# Altium schematic sheet Eload Gen 3 Power Module - User Inferface.SchDoc
size B
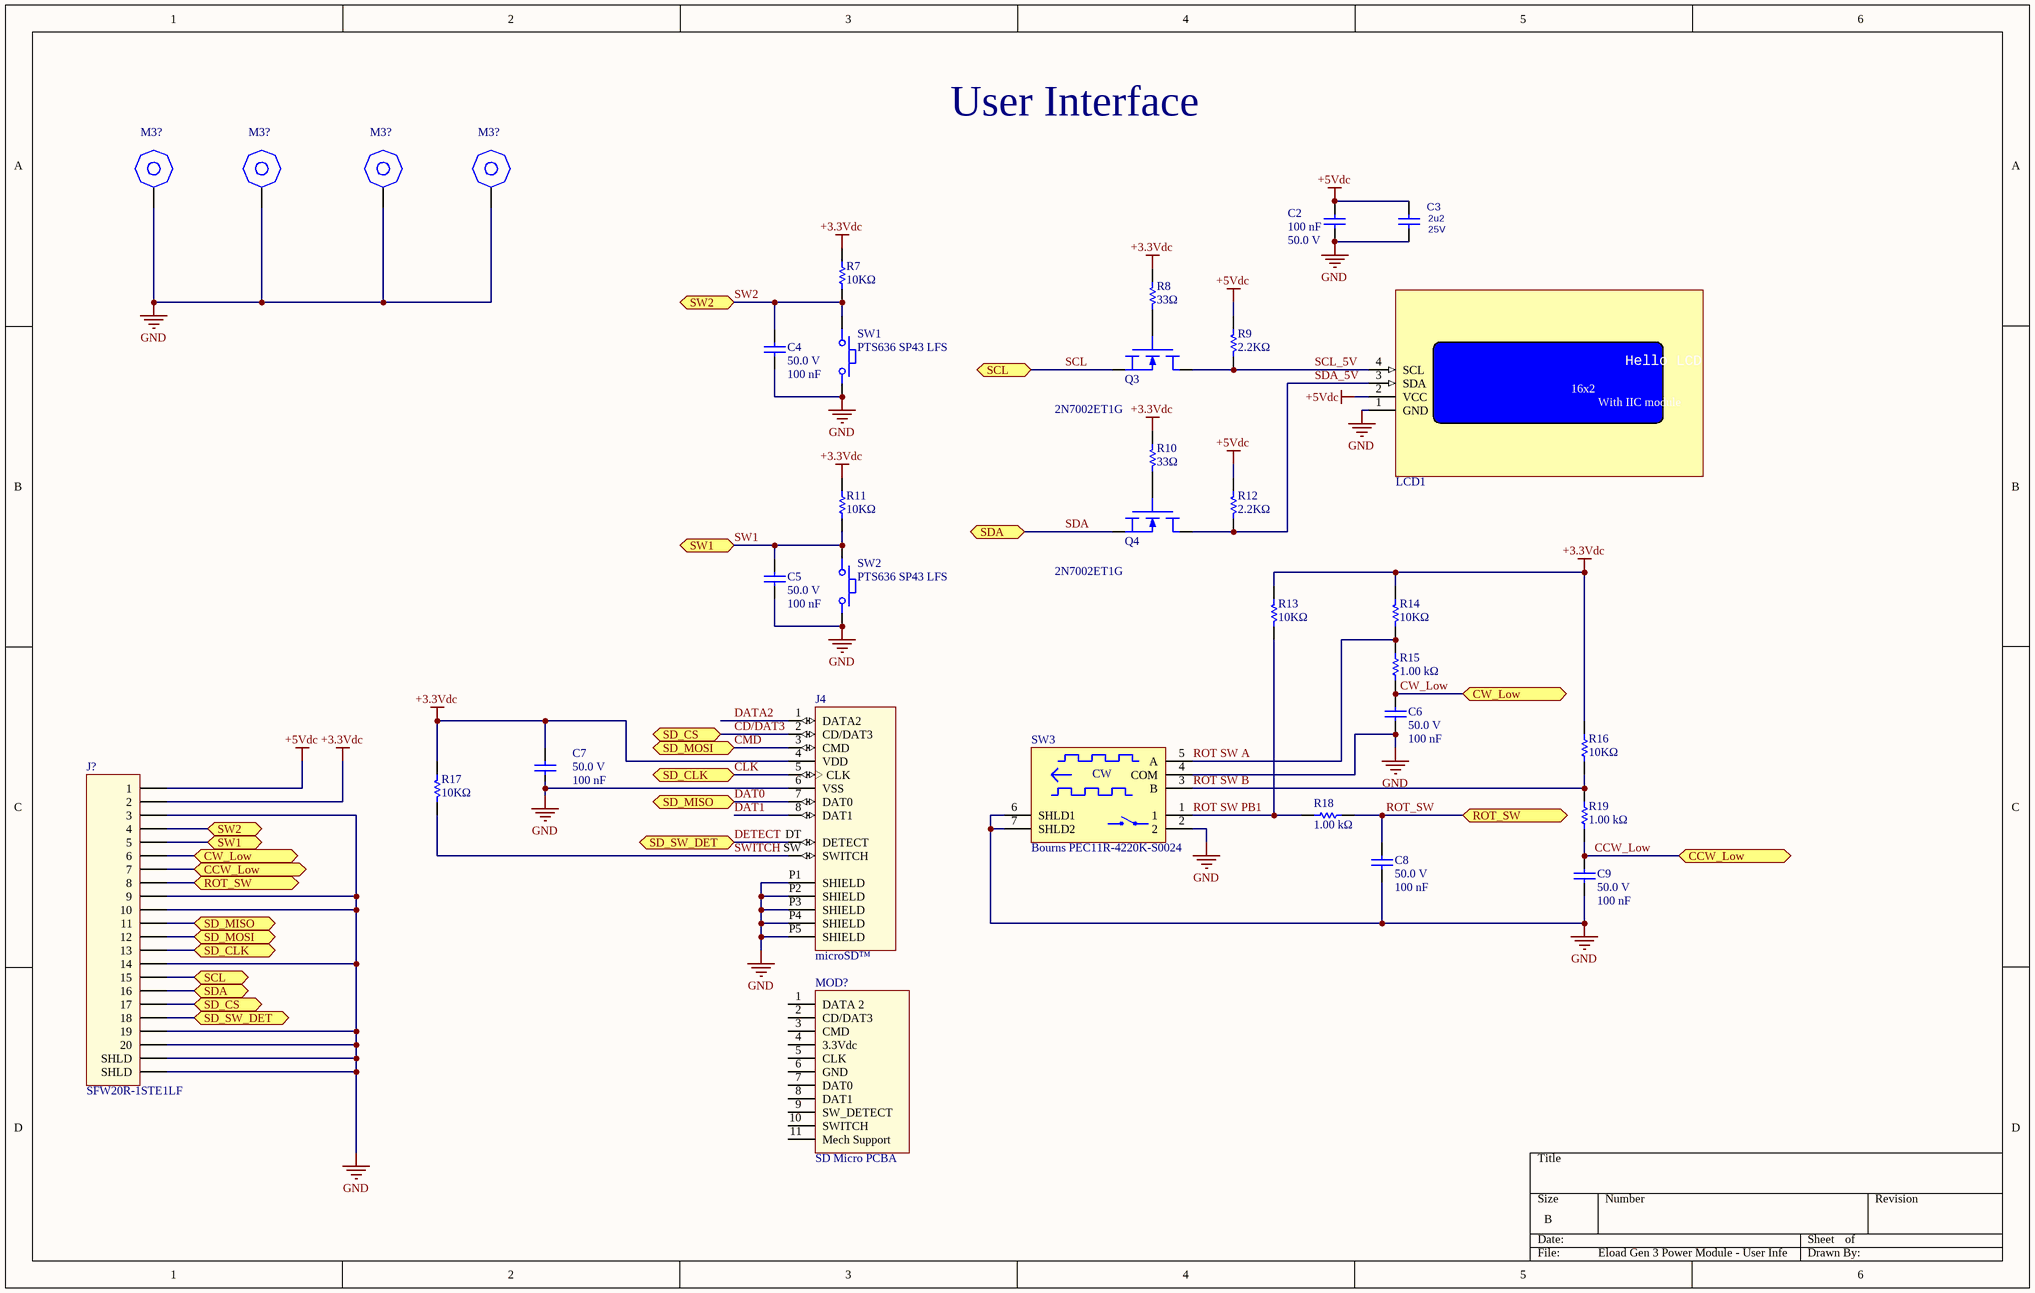
[diagram p0: Eload Gen 3 Power Module - User Inferface.SchDoc]

## Parts
(Parts that share a designator on the sheet are numbered #1, #2 ... from top to bottom, then left to right.)
C2  Voltage Rating (DC): 50.0 V  Capacitance: 100 nF  [Cap,0805]  (hidden comment: 08055C104JAT2A)
C3  2u2  Voltage: 25V  [CAP, 0805, HD]  (net tie)
C4  Voltage Rating (DC): 50.0 V  Capacitance: 100 nF  [CAP, 0805, HD]  (hidden comment: 08055C104JAT2A)
C5  Voltage Rating (DC): 50.0 V  Capacitance: 100 nF  [CAP, 0805, HD]  (hidden comment: 08055C104JAT2A)
C6  Voltage Rating (DC): 50.0 V  Capacitance: 100 nF  [CAP, 0805, HD]  (hidden comment: 08055C104JAT2A)
C7  Voltage Rating (DC): 50.0 V  Capacitance: 100 nF  [Cap,0805]  (hidden comment: 08055C104JAT2A)
C8  Voltage Rating (DC): 50.0 V  Capacitance: 100 nF  [CAP, 0805, HD]  (hidden comment: 08055C104JAT2A)
C9  Voltage Rating (DC): 50.0 V  Capacitance: 100 nF  [CAP, 0805, HD]  (hidden comment: 08055C104JAT2A)
J4  Card Type: microSD™  [Conn,SD micro,503182-1852]  (hidden comment: 5031821852)
J?  SFW20R-1STE1LF  [Connector,FlatFlex,20Pin,RA]
LCD1  LCD, 20x4  [LCD Module 16x2 - IIC MOD]  (value not drawn)
M3?#1  M3 hex Standoff  [Standoff,Hex,M3,8mm]  (value not drawn)  (mechanical)
M3?#2  M3 hex Standoff  [Standoff,Hex,M3,8mm]  (value not drawn)  (mechanical)
M3?#3  M3 hex Standoff  [Standoff,Hex,M3,8mm]  (value not drawn)  (mechanical)
M3?#4  M3 hex Standoff  [Standoff,Hex,M3,8mm]  (value not drawn)  (mechanical)
MOD?  Discription: SD Micro PCBA  [Mod, SD Card Connector Breakout]  (hidden comment: SD Card Connector Breakout)
Q3  2N7002ET1G  [SOT23-3]
Q4  2N7002ET1G  [SOT23-3]
R7  Resistance: 10KΩ  [res, 0805, HD]  (hidden comment: Vishay / Dale CRCW080510K0FKTA)
R8  Resistance: 33Ω  [res, 0805, HD]  (hidden comment: CR0805-JW-330ELF)
R9  Resistance: 2.2KΩ  [res, 0805, HD]  (hidden comment: CRCW08052K20FKEA)
R10  Resistance: 33Ω  [res, 0805, HD]  (hidden comment: CR0805-JW-330ELF)
R11  Resistance: 10KΩ  [res, 0805, HD]  (hidden comment: Vishay / Dale CRCW080510K0FKTA)
R12  Resistance: 2.2KΩ  [res, 0805, HD]  (hidden comment: CRCW08052K20FKEA)
R13  Resistance: 10KΩ  [res, 0805, HD]  (hidden comment: Vishay / Dale CRCW080510K0FKTA)
R14  Resistance: 10KΩ  [res, 0805, HD]  (hidden comment: Vishay / Dale CRCW080510K0FKTA)
R15  Resistance: 1.00 kΩ  [res, 0805, HD]  (hidden comment: Vishay CRCW08051K00JNEA)
R16  Resistance: 10KΩ  [res, 0805, HD]  (hidden comment: Vishay / Dale CRCW080510K0FKTA)
R17  Resistance: 10KΩ  [res, 0805, HD]  (hidden comment: Vishay / Dale CRCW080510K0FKTA)
R18  Resistance: 1.00 kΩ  [res, 0805, HD]  (hidden comment: Vishay CRCW08051K00JNEA)
R19  Resistance: 1.00 kΩ  [res, 0805, HD]  (hidden comment: Vishay CRCW08051K00JNEA)
SW1  PTS636 SP43 LFS  [PTS636 SP43 LFS]
SW2  PTS636 SP43 LFS  [PTS636 SP43 LFS]
SW3  Bourns PEC11R-4220K-S0024  [Rotary encoder]

## Ports
CCW_Low, CW_Low, ROT_SW, SCL, SD_CLK, SD_CS, SD_MISO, SD_MOSI, SD_SW_DET, SDA, SW1, SW2

## Nets
+3.3Vdc: C7.2 J4.4(VDD) J?.2 R7.1 R8.1 R10.1 R11.1 R13.2 R14.2 R16.1 R17.1
+5Vdc: C2.2 C3.2 J?.1 LCD1.2(VCC) R9.2 R12.2
GND: C2.1 C3.1 C4.1 C5.1 C6.1 C7.1 C8.1 C9.1 J4.6(VSS) J4.P1(SHIELD) J4.P2(SHIELD) J4.P3(SHIELD) J4.P4(SHIELD) J4.P5(SHIELD) J?.3 J?.9 J?.10 J?.14 J?.19 J?.20 J?.21(SHLD) J?.22(SHLD) LCD1.1(GND) M3?#1.0 M3?#2.0 M3?#3.0 M3?#4.0 SW1.2 SW2.2 SW3.2 SW3.4(COM) SW3.6(SHLD1) SW3.7(SHLD2)
CCW_Low: C9.2 J?.7 R19.2 ; port CCW_Low
CD/DAT3: J4.2(CD/DAT3) J?.17 ; port SD_CS
CLK: J4.5(CLK) J?.13 ; port SD_CLK
CMD: J4.3(CMD) J?.12 ; port SD_MOSI
CW_Low: C6.2 J?.6 R15.2 ; port CW_Low
DAT0: J4.7(DAT0) J?.11 ; port SD_MISO
DAT1: J4.8(DAT1)
DATA2: J4.1(DATA2)
DETECT: J4.DT(DETECT) J?.18 ; port SD_SW_DET
ROT SW A: R14.1 R15.1 SW3.5(A)
ROT SW B: R16.2 R19.1 SW3.3(B)
ROT SW PB1: R13.1 R18.1 SW3.1
ROT_SW: C8.2 J?.8 R18.2 ; port ROT_SW
SCL: J?.15 Q3.2(S) ; port SCL
SCL_5V: LCD1.4(SCL) Q3.3(D) R9.1
SDA: J?.16 Q4.2(S) ; port SDA
SDA_5V: LCD1.3(SDA) Q4.3(D) R12.1
SW1: C5.2 J?.5 R11.2 SW2.1 ; port SW1
SW2: C4.2 J?.4 R7.2 SW1.1 ; port SW2
SWITCH: J4.SW(SWITCH) R17.2
NetQ3_1: Q3.1(G) R8.2
NetQ4_1: Q4.1(G) R10.2

Not connected (* = marked no-connect by the designer): MOD? 1(DATA_2) 2(CD/DAT3) 3(CMD) 4(3.3Vdc) 5(CLK) 6(GND) 7(DAT0) 8(DAT1) 9(SW_DETECT) 10(SWITCH) 11(Mech_Support)

## Notes on the sheet
- User Interface
- (in symbol LCD, 16x2, IIC) Hello LCD World; 16x2; With IIC module
- (in symbol Rotary encoder, PEC11R-4220K-S0024) CW

## Library data of the parts
C2 C4-C9 = Cap,0805,100nf,50V,5%,08055C104JAT2A: Capacitor; Ceramic; Cap 0.1 uF; Tol 5%; Vol-Rtg 50 VDC; SMT; 0805; X7R; Tape & Reel; Lead-Free Status: Lead Free; Case/Package (SI): 2012; Insulation Resistance: 100 GΩ; Detailed Description: 0.1µF ±5% 50V Ceramic Capacitor X7R 0805 (2012 Metric); Mounting Style: Surface Mount; Packaging: Tape & Reel (TR), Cut Tape (CT); RoHS: Compliant; Size-Width: 1.24 mm; Case/Package: 0805; Number of Pins: 2; digikey url: http://www.digikey.ca/product-detail/en/avx-corporation/08055C104JAT2A/478-3352-1-ND/930144; REACH SVHC Compliance: No SVHC; Dielectric Characteristic: X7R; Capacitance Tolerance: ±5%; Size-Length: 2.01 mm; Size-Height: 710 µm; Size-Thickness: 940 µm; Manufacturer Part Number: 08055C104JAT2A; Octopart URL: http://octopart.com/08055c104jat2a-avx-55388010; Operating Temperature: -55°C ~ 125°C; Supplier 1: Digi-Key; Supplier Part Number 1: 478-3352-1-ND
C3 = Cap,0805,2.2uF,10%,25V: Cap,SMD,MLCC,2.2uF 25V X7R 10%,0805; Manufacturer: Murata; Manufacturer P/N: GRM21BR71E225KA73L (t&r, 3Kpcs); P/N: 211-121-19; iPS: 951-22501-R1; Not Stuffed: N/S; Temperature Category: -55~125 degC.; Fast Supplier: Digi-Key; Fast Supplier P/N: 490-3331-1-ND; Type: X7R
J4 = Conn,SD Micro,10 (8 + 2) Position,SMD,RA,5031821852: MICRO SD NORMAL ULTRALOWPRO8CKTE; Manufacturer: Molex; Detailed Description: 10 (8 + 2) Position Card Connector microSD™ Surface Mount, Right Angle Gold; Categories: Connectors, Interconnects   Memory Connectors - PC Card Sockets; Connector Type: Connector and Ejector; Insertion, Removal Method: Push In, Push Out; mfg P/N: 5031821852; Series: 503182; Part Status: Active; Number of Positions: 10 (8 + 2); Mounting Type: Surface Mount, Right Angle; Features: Switch; Height Above Board: 0.057" (1.45mm); Mounting Feature: Normal, Standard - Top; Contact Finish: Gold
J? = Connector,FFC,SMD,20Pin,1mmSpc,SFW20R-1STE1LF: CONN FFC BOTTOM 20POS 1.00MM R/A; Manufacturer: Amphenol ICC (FCI); Detailed Description: 20 Position FFC, FPC Connector Contacts, Bottom 0.039" (1.00mm) Surface Mount, Right Angle; Categories: Connectors, Interconnects   FFC, FPC (Flat Flexible) Connectors; Flat Flex Type: FFC, FPC; Connector/Contact Type: Contacts, Bottom; Number of Positions: 20; Pitch: 0.039" (1.00mm); FFC, FCB Thickness: 0.30mm, 0.33mm; Locking Feature: Slide Lock; Cable End Type: Straight, Tapered; Actuator Material: Polyphenylene Sulfide (PPS), Glass Filled; Voltage Rating: 100V; Material Flammability Rating: UL94 V-0; Current Rating (Amps): 1A; Actuator Color: Black; mfg P/N: SFW20R-1STE1LF; Mounting Type: Surface Mount, Right Angle; Termination: Solder; Height Above Board: 0.106" (2.70mm); Contact Material: Phosphor Bronze; Contact Finish: Tin; Housing Material: Polyphenylene Sulfide (PPS), Glass Filled; Features: Zero Insertion Force (ZIF); Operating Temperature: -55°C ~ 105°C; Housing Color: Brown; Mating Cycles: 20; Supplier 1: Digi-Key; Supplier Part Number 1: 609-1913-6-ND
LCD1 = LCD, 16x2, IIC: LCD Character Display; 4x20 Char.; 98x60; STN- BLUE; Transmissive; 8-Bit Parallel; Supplier 1: Digi-Key
M3?#1-M3?#4 = Mech,Standoff, M3, Hex: HEX STANDOFF M3,generic; Supplier 1: Digi-Key; Supplier Part Number 1: 36-24314-ND
MOD? = Mod,SD Card breakout, Vertical
Q3 Q4 = MOSFET,N-Channel,SOT23,0.25A,60V,2N7002ET1G: Small Signal MOSFET, 60 V, 310 mA, Single, N-Channel, 3-Pin SOT-23, Pb-Free, Tape and Reel; Manufacturer: ON Semiconductor; Continuous Drain Current (Ids): 0.25A; Lead-Free Status: Lead Free; Drain to Source Voltage (Vds): 60.0 V; Power Dissipation (Max): 350mW (Ta); REACH SVHC Compliance: No SVHC; Number of Pins: 3; Halogen Free Status: Halogen Free; Case/Package: SOT-23-3; Polarity: N-Channel; RoHS: Compliant; Lifecycle Status: Active; Manufacturer Part Number: 2N7002ET1G; Supplier 1: Digi-Key; Supplier Part Number 1: 2N7002ET1GOSCT-ND; Supplier 2: LCSC; Supplier Part Number 2: C71533
R7 R11 R13 R14 R16 R17 = Res,0805,10.0kΩ,1%,100 ppm,CRCW080510K0FKTA: RES SMD 10K OHM 1% 1/8W 0805; Temperature Coefficient: 100.0 ppm/C; Lead-Free Status: Contains Lead; Voltage Rating (DC): 150.0 V; Power Rating: 0.125 W; Case/Package (SI): 2012; Size-Width: 0.00125 m; Resistance Tolerance: 1%; Size-Length: 0.002 m; RoHS: Non-Compliant; Power Dissipation: 0.125 W; Number of Pins: 2; REACH SVHC Compliance: No SVHC; Size-Height: 0.00045 m; Case/Package: 0805; Mounting Style: Surface Mount; Supplier 1: Digi-Key; Supplier Part Number 1: 541-3016-1-ND
R8 R10 = Res,0805,33Ω,±5%,200ppm,CR0805-JW-330ELF: RES SMD 33 OHM 5% 1/8W 0805; Manufacturer: Bourns Inc.; Detailed Description: 33 Ohms ±5% 0.125W, 1/8W Chip Resistor 0805 (2012 Metric) Moisture Resistant Thick Film; Categories: Resistors   Chip Resistor - Surface Mount; Power (Watts): 0.125W, 1/8W; Temperature Coefficient: ±200ppm/°C; mfg P/N: CR0805-JW-330ELF; Series: CR0805; Part Status: Active; Tolerance: ±5%; Composition: Thick Film; Features: Moisture Resistant; Operating Temperature: -55°C ~ 155°C; Package / Case: 0805 (2012 Metric); Supplier Device Package: 0805; Size / Dimension: 0.079" L x 0.049" W (2.00mm x 1.25mm); Height - Seated (Max): 0.024" (0.60mm); Number of Terminations: 2; Base Part Number: CR0805; Supplier 1: Digi-Key; Supplier Part Number 1: 118-CR0805-JW-330ELFCT-ND
R9 R12 = Res,0805,2.2KΩ,±1%,100.0 ppm/°C,150.0 V,CRCW08052K20FKEA: RES SMD 2.2K OHM 1% 1/8W 0805; Case/Package (SI): 2012; Lead-Free Status: Lead Free; Power Rating: 0.125 W; Voltage Rating (DC): 150.0 V; Case/Package: 0805; Mounting Style: Surface Mount; Number of Pins: 2; REACH SVHC Compliance: No SVHC; Resistance Tolerance: ±1%; RoHS: Compliant; Size-Height: 0.00045 m; Size-Length: 0.002 m; Size-Width: 0.00125 m; Temperature Coefficient: 100.0 ppm/°C; mfg P/N: CRCW08052K20FKEA; Supplier 1: Digi-Key; Supplier Part Number 1: 541-2.20KCCT-ND
R15 R18 R19 = Res,0805,1.00 kΩ,5%,200ppm,CRCW08051K00JNEA: Res Thick Film 0805 1K Ohm 5% 0.125W(1/8W) ±200ppm/C Molded SMD Automotive Paper T/R; Power Rating: 125 mW; Case/Package (SI): 2012; Lead-Free Status: Lead Free; Temperature Coefficient: 200 ppm/°C; Voltage Rating (DC): 150 V; Size-Width: 1.25 mm; Mounting Style: Surface Mount; REACH SVHC Compliance: No SVHC; Manufacturer Part Number: CRCW08051K00JNEA; Number of Pins: 2; Size-Height: 450 µm; Packaging: Tape & Reel (TR), Cut Tape (CT); RoHS: Compliant; Resistance Tolerance: ±5%; Case/Package: 0805; Size-Length: 2.00 mm; Supplier 1: Digi-Key; Supplier Part Number 1: 541-1.0KADKR-ND
SW1 SW2 = Switch,Through Hole,Tactile,SPST-NO,PTS636 SP43 LFS: Tactile Switch SPST-NO Top Actuated Through Hole; Manufacturer: C&K; Categories: Switches   Tactile Switches; Switch Function: Off-Mom; Contact Rating @ Voltage: 0.05A @ 12VDC; Actuator Type: Rectangular Button; Actuator Height off PCB, Vertical: 4.30mm; Outline: 6.00mm x 3.50mm; Illumination: Non-Illuminated; Operating Force: 320gf; Ingress Protection: IP40; Switch Travel: 0.30mm; Mechanical Life: 20,000 Cycles; mfg P/N: PTS636 SP43 LFS; Detailed Description: Tactile Switch SPST-NO Top Actuated Through Hole; Series: PTS636; Part Status: Active; Circuit: SPST-NO; Mounting Type: Through Hole; Actuator Orientation: Top Actuated; Termination Style: PC Pin; Operating Temperature: -20°C ~ 70°C; Supplier 1: Digi-Key; Supplier Part Number 1: CKN12304-ND
SW3 = Rotary encoder, PEC11R-4220K-S0024: 24 Pulse Incremental Mechanical Rotary Encoder w/ 6 mm Knurl Shaft, Through Hole; Size-Width: 12.5 mm; RoHS: Compliant; Supplier 1: Digi-Key; Supplier Part Number 1: PEC11R-4020K-S0024-ND